# Altium schematic sheet Power.SchDoc
size A3
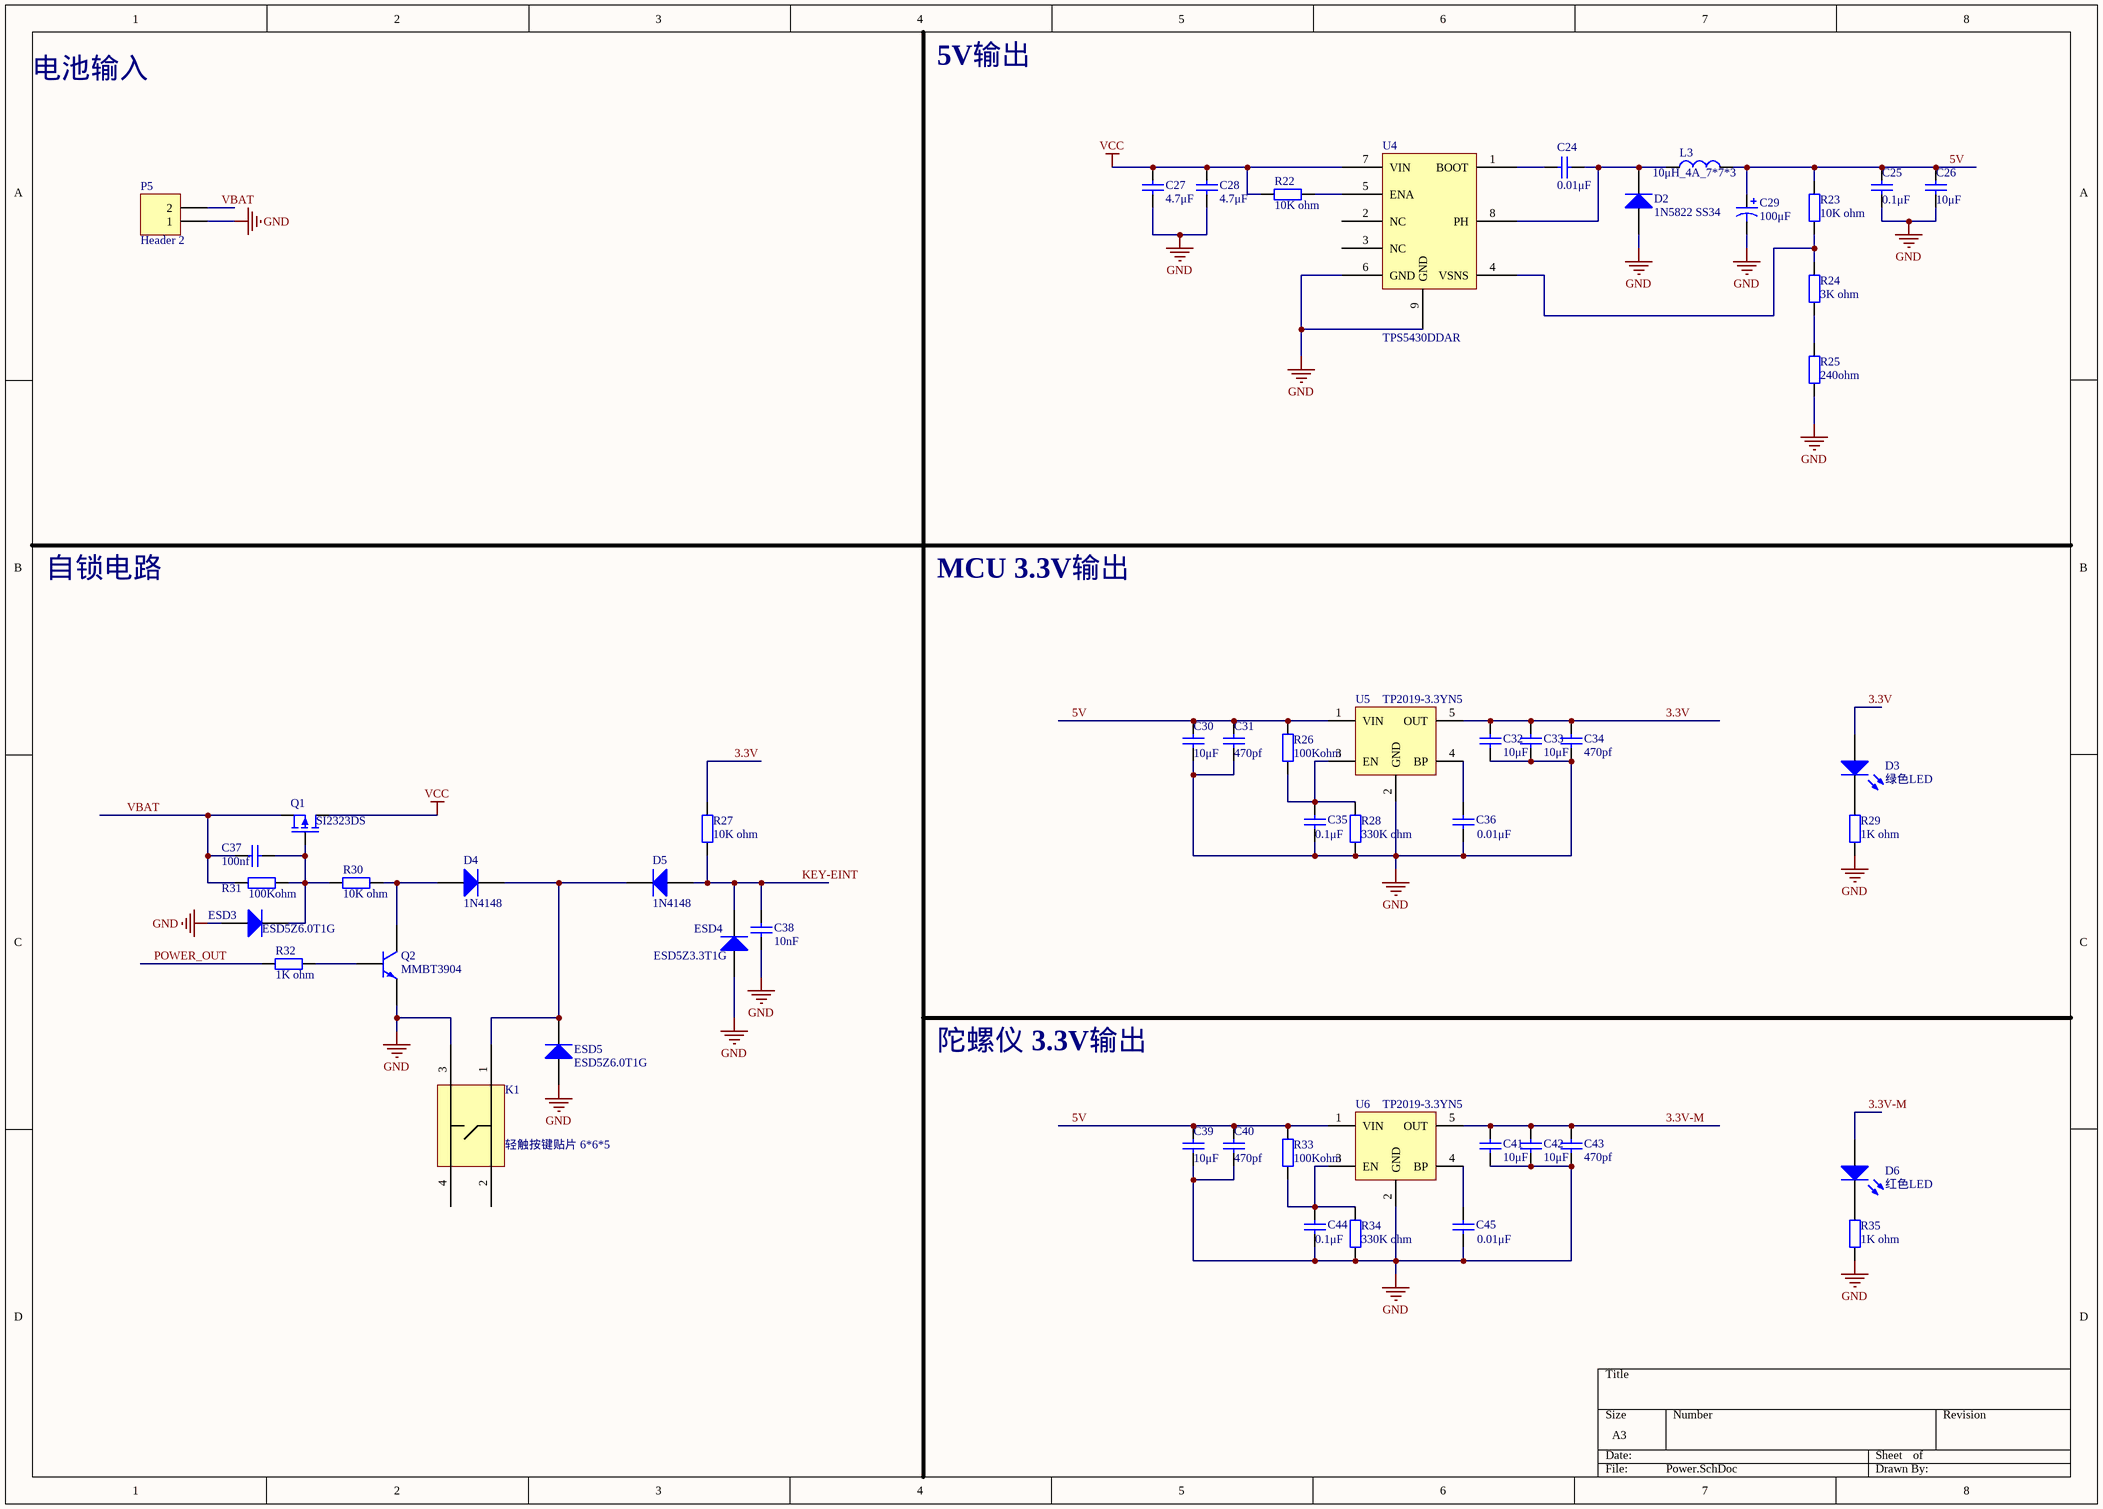
[diagram p0: Power.SchDoc]

## Parts
C24  0.01μF  [0603C]
C25  0.1μF  [0603C]
C26  10μF  [1206C]
C27  4.7μF  [1206C]
C28  4.7μF  [1206C]
C29  100μF  [D7343C]
C30  10μF  [0603C]
C31  470pf  [0603C]
C32  10μF  [0603C]
C33  10μF  [0603C]
C34  470pf  [0603C]
C35  0.1μF  [0603C]
C36  0.01μF  [0603C]
C37  100nf  [0603C]
C38  10nF  [0603C]
C39  10μF  [0603C]
C40  470pf  [0603C]
C41  10μF  [0603C]
C42  10μF  [0603C]
C43  470pf  [0603C]
C44  0.1μF  [0603C]
C45  0.01μF  [0603C]
D2  1N5822 SS34  [SMA-small]
D3  绿色LED  [0603LED]
D4  1N4148  [SOD323]
D5  1N4148  [SOD323]
D6  红色LED  [0603LED]
ESD3  ESD5Z6.0T1G  [SOD523]
ESD4  ESD5Z3.3T1G  [SOD523]
ESD5  ESD5Z6.0T1G  [SOD523]
K1  轻触按键贴片 6*6*5  [轻触按键贴片 6*6*5]
L3  10μH_4A_7*7*3  [7*7*3mm - 06030]
P5  Header 2  [HDR1X2]
Q1  SI2323DS  [SOT-23]
Q2  MMBT3904  [SOT-23]
R22  10K ohm  [0603R]
R23  10K ohm  [0603R]
R24  3K ohm  [0603R]
R25  240ohm  [0603R]
R26  100Kohm  [0603R]
R27  10K ohm  [0603R]
R28  330K ohm  [0603R]
R29  1K ohm  [0603R]
R30  10K ohm  [0603R]
R31  100Kohm  [0603R]
R32  1K ohm  [0603R]
R33  100Kohm  [0603R]
R34  330K ohm  [0603R]
R35  1K ohm  [0603R]
U4  TPS5430DDAR  [SOIC8-PAD]
U5  TP2019-3.3YN5  [SOT-23-5]
U6  TP2019-3.3YN5  [SOT-23-5]

## Nets
GND: C25.1 C26.1 C27.2 C28.1 C29.2 C30.1 C31.1 C32.1 C33.1 C34.1 C35.1 C36.1 C38.1 C39.1 C40.1 C41.1 C42.1 C43.1 C44.1 C45.1 D2.1(A) ESD3.1(A) ESD4.1(A) ESD5.1(A) K1.3 P5.1 Q2.3(E) R25.1 R28.1 R29.1 R34.1 R35.1 U4.6(GND) U4.9(GND) U5.2(GND) U6.2(GND)
VCC: C27.1 C28.2 Q1.2(D) R22.1 U4.7(VIN)
3.3V: C32.2 C33.2 C34.2 D3.1(A) R27.2 U5.5(OUT)
3.3V-M: C41.2 C42.2 C43.2 D6.1(A) U6.5(OUT)
5V: C25.2 C26.2 C29.1 C30.2 C31.2 C39.2 C40.2 L3.2 R23.2 R26.2 R33.2 U5.1(VIN) U6.1(VIN)
KEY-EINT: C38.2 D5.1(A) ESD4.2(K) R27.1
POWER_OUT: R32.1
VBAT: C37.1 P5.2 Q1.3(S) R31.1
NetC24_1: C24.1 U4.1(BOOT)
NetC24_2: C24.2 D2.2(K) L3.1 U4.8(PH)
NetC35_2: C35.2 R26.1 R28.2 U5.3(EN)
NetC36_2: C36.2 U5.4(BP)
NetC37_2: C37.2 ESD3.2(K) Q1.1(G) R30.1 R31.2
NetC44_2: C44.2 R33.1 R34.2 U6.3(EN)
NetC45_2: C45.2 U6.4(BP)
NetD3_2: D3.2(K) R29.2
NetD4_1: D4.1(A) Q2.2(C) R30.2
NetD4_2: D4.2(K) D5.2(K) ESD5.2(K) K1.1
NetD6_2: D6.2(K) R35.2
NetQ2_1: Q2.1(B) R32.2
NetR22_2: R22.2 U4.5(ENA)
NetR23_1: R23.1 R24.2 U4.4(VSNS)
NetR24_1: R24.1 R25.2

Not connected (* = marked no-connect by the designer): K1 2 4; U4 2(NC) 3(NC)

## Notes on the sheet
- 电池输入
- 5V输出
- 自锁电路
- MCU 3.3V输出
- 陀螺仪 3.3V输出

## Library data of the parts
C24 C36 C45 = Cap_0.01μF_50V_0603: 0.01μF_50V,C0G,5%; 物料名称: 贴片陶瓷电容; 制造商: muRata; 物料编码: TCC0038; 物料型号: GRM1885C1H103JA01D; 单位: PCS; 物料规格: 0.01μF_50V,C0G,5%
C25 C35 C44 = Cap_0.1μF_50V_0603: 0.1μF_50V,X7R,±5%; 物料名称: 贴片陶瓷电容; 制造商: muRata; 物料编码: TCC0087; 物料型号: GRM188R71H104JA93D; 单位: PCS; 物料规格: 0.1μF_50V,X7R,±5%
C26 = Cap_10μF_10V_1206: 10μF_10V,10%; 物料名称: 贴片陶瓷电容; 制造商: TDK; 物料编码: TCC0048; 物料型号: C3216JB1A106KT; 单位: PCS; 物料规格: 10μF_10V,10%
C27 C28 = Cap_4.7μF_35V_1206: 4.7μF_35VJB,±10%; 物料名称: 贴片陶瓷电容; 制造商: TDK; 物料编码: NA; 物料型号: C3216JB1V475K085AB; 单位: PCS; 物料规格: 4.7μF_35VJB,±10%
C29 = Cap_100μF_16V_D7343: 100μF_16V; 物料名称: 钽电容; 制造商: AVX; 物料编码: NA; 物料型号: TAJC107M016RNJ; 单位: PCS; 物料规格: 100μF_16V
C30 C32 C33 C39 C41 C42 = Cap_10μF_35V_0603: 10μF_35V,X5R,20%; 物料规格: 10μF_35V,20%; 物料名称: 贴片陶瓷电容; 制造商: muRata; 物料编码: TCC0071; 物料型号: GRM188R6YA106MA73D; 单位: PCS
C31 C34 C40 C43 = Cap_470pf_50V_0603: 470pf_50V,X7R,10%; 物料名称: 贴片陶瓷电容; 制造商: muRata; 物料编码: NA; 单位: PCS; 物料规格: 470pf_50V,X7R,10%; 物料型号: NA
C37 = Cap_100nf_50V_0603: 100nf_50V,X5R,10%; 物料名称: 贴片陶瓷电容; 制造商: muRata; 单位: PCS; 物料规格: 100nf_50V,X5R,10%
C38 = Cap_10nF_16V_0603: 10nF/16V,0603; 物料名称: 贴片陶瓷电容; 制造商: YAGEO; 物料编码: NA; 单位: PCS; 物料规格: Cap_10nF_16V_0603; 物料型号: NA
D2 = 1N5822 SS34_SMA: 物料名称: 表贴齐纳二极管; 制造商: VISHAY; 物料编码: NA; 单位: PCS; 物料规格: 1N5822 SS34; 物料型号: 1N5822 SS34
D3 D6 = 蓝色LED: 物料规格: LED(蓝色）; 制造商: VISHAY; 物料编码: TRG0035; 物料型号: TLMB1100; 单位: PCS; 物料名称: LED(蓝色）
D4 D5 = 1N4148WS_SOD323: 1N4148WS; 物料名称: 表贴齐纳二极管; 制造商: DIODES; 物料编码: NA; 物料型号: 1N4148WS / BAV16WS; 单位: PCS; 物料规格: 1N4148
ESD3 ESD5 = ESD5Z6.0T1G_SOD523: 物料名称: ESD二极管; 制造商: 安森美; 物料编码: NA; 单位: PCS; 物料规格: ESD5Z6.0T1G; 物料型号: ESD5Z6.0T1G
ESD4 = ESD5Z3.3T1G_SOD523: 物料名称: ESD二极管; 制造商: 安森美; 物料编码: NA; 单位: PCS; 物料规格: ESD5Z3.3T1G; 物料型号: ESD5Z3.3T1G
K1 = 轻触按键贴片 6*6*5: 制造商: 淘宝; 物料编码: NA; 单位: PCS; 物料规格: 轻触按键贴片 6*6*5; 物料名称: 轻触按键贴片 6*6*5; 物料型号: 轻触按键贴片 6*6*5
L3 = 10μH_4A_7*7*3: 10μH_4A; 物料名称: 功率电感; 制造商: 台湾奇力新; 物料编码: NA; 物料型号: MHCC10040-100M-R7_06030; 单位: PCS; 物料规格: 10μH_4A_7*7*3
P5 = Header 2: Header, 2-Pin; LatestRevisionDate: 17-Jul-2002; LatestRevisionNote: Re-released for DXP Platform.; Publisher: Altium Limited
Q1 = SI2323DS: 物料名称: NMOS; 制造商: VISHAY; 物料编码: NA; 单位: PCS; 物料规格: SI2323DS; 物料型号: SI2323DS
Q2 = MMBT3904: 物料名称: NPN三极管; 制造商: NXP; 物料编码: TSG0006; 单位: PCS; 物料规格: MMBT3904; 物料型号: MMBT3904
R22 R23 R27 R30 = Res_10K ohm_0603: 10K ohm,1%; 物料名称: 贴片电阻; 制造商: YAGEO; 物料编码: TRS0020; 物料型号: RC0603FR-0710KL; 单位: PCS; 物料规格: 10K ohm,1%
R24 = Res_3K ohm_0603: 3K ohm,1%; 物料名称: 贴片电阻; 制造商: YAGEO; 单位: PCS; 物料规格: 3K ohm,1%
R25 = Res_240ohm_0603: 240ohm,1%; 物料名称: 贴片电阻; 制造商: YAGEO; 物料编码: NA; 物料型号: RC0603FR-07240RL; 单位: PCS; 物料规格: 240ohm,1%
R26 R33 = Res_100Kohm_0603: 100K ohm_1%; 物料名称: 贴片电阻; 制造商: YAGEO; 物料编码: TRS0032; 物料型号: RC0603JR-07100K; 单位: PCS; 物料规格: 100K ohm_1%
R28 R34 = Res_330K ohm_0603: 330K ohm,1%; 物料名称: 贴片电阻; 制造商: YAGEO; 物料编码: NA; 物料型号: RC0603FR-07330KL; 单位: PCS; 物料规格: 330K ohm,1%
R29 R32 R35 = Res_1K ohm_0603: 1K ohm,1%; 物料名称: 贴片电阻; 制造商: YAGEO; 物料编码: TRS0043; 物料型号: RC0603FR-071KL; 单位: PCS; 物料规格: 1K ohm,1%
R31 = Res_100Kohm_0603: 100K ohm_5%; 物料名称: 贴片电阻; 制造商: YAGEO; 物料编码: TRS0032; 物料型号: RC0603JR-07100K; 单位: PCS; 物料规格: 100K ohm_5%
U4 = TPS5430DDAR: 物料名称: 降压芯片; 制造商: TI; 物料编码: NA; 单位: PCS; 物料规格: TPS5430DDAR; 物料型号: TPS5430DDAR
U5 U6 = TP2019-3.3YN5: 物料名称: 3.3v电源; 制造商: Tech Public 台舟电子; 物料编码: NA; 单位: PCS; 物料规格: TP2019-3.3YN5; 物料型号: TP2019-3.3YN5